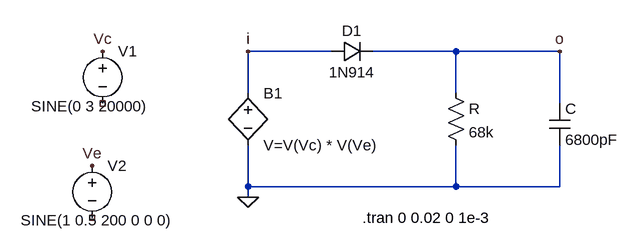
[diagram p0: schematic envelope_detector.asc]
envelope_detector.asc, the LTspice schematic file:
Version 4
SHEET 1 880 680
WIRE 224 48 96 48
WIRE 416 48 288 48
WIRE 576 48 416 48
WIRE 96 112 96 48
WIRE 416 112 416 48
WIRE 576 128 576 48
WIRE 96 256 96 192
WIRE 416 256 416 192
WIRE 416 256 96 256
WIRE 576 256 576 192
WIRE 576 256 416 256
WIRE 96 272 96 256
FLAG 96 272 0
FLAG 96 48 i
FLAG 576 48 o
FLAG -128 48 Vc
FLAG -144 224 Ve
SYMBOL voltage -128 32 R0
WINDOW 3 -110 100 Left 2
WINDOW 123 0 0 Left 0
WINDOW 39 0 0 Left 0
SYMATTR Value SINE(0 3 20000)
SYMATTR InstName V1
SYMBOL diode 224 64 R270
WINDOW 0 32 32 VTop 2
WINDOW 3 0 32 VBottom 2
SYMATTR InstName D1
SYMATTR Value 1N914
SYMBOL res 400 96 R0
SYMATTR InstName R
SYMATTR Value 68k
SYMBOL cap 560 128 R0
SYMATTR InstName C
SYMATTR Value 6800pF
SYMBOL voltage -144 208 R0
WINDOW 3 -110 100 Left 2
WINDOW 123 0 0 Left 0
WINDOW 39 0 0 Left 0
SYMATTR Value SINE(1 0.5 200 0 0 0)
SYMATTR InstName V2
SYMBOL bv 96 96 R0
SYMATTR InstName B1
SYMATTR Value V=V(Vc) * V(Ve)
TEXT 272 304 Left 2 !.tran 0 0.02 0 1e-3

The netlist it stands for:
* envelope_detector.asc
V1 Vc NC_01 SINE(0 3 20000)
D1 i o 1N914
R o 0 68k
C o 0 6800pF
V2 Ve NC_02 SINE(1 0.5 200 0 0 0)
B1 i 0 V=V(Vc) * V(Ve)
.model D D
.lib standard.dio
.tran 0 0.02 0 1e-3
.backanno
.end